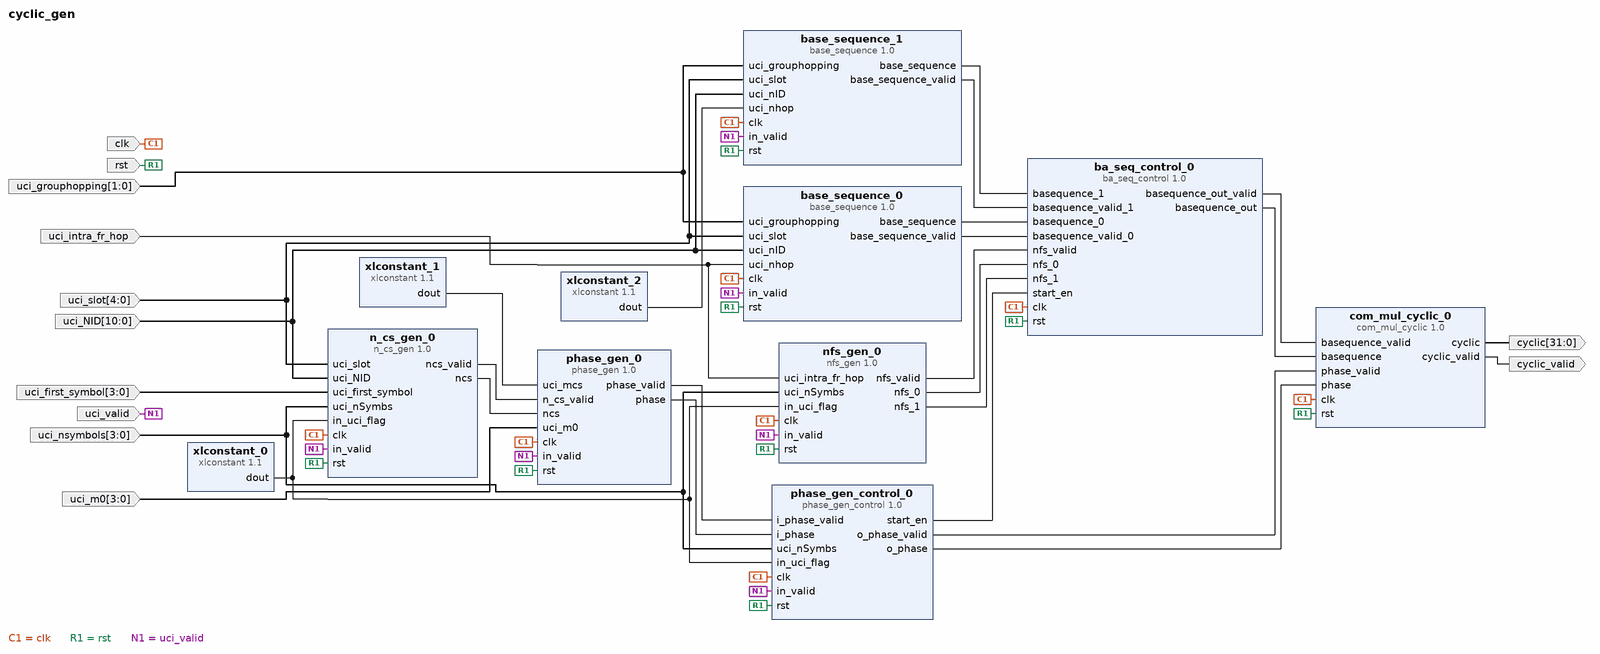
[diagram p0: block diagram of the top level]
# Vivado block design cyclic_gen, xcvu9p-flga2104-2L-e, Vivado 2019.2
create_bd_design cyclic_gen

create_bd_port -dir I -type clk clk
set_property -dict {CONFIG.FREQ_HZ 100000000} [get_bd_ports clk]
create_bd_port -dir I -type rst rst
set_property -dict {CONFIG.POLARITY ACTIVE_HIGH} [get_bd_ports rst]
create_bd_port -dir I uci_valid
create_bd_port -dir I -from 4 -to 0 uci_slot
create_bd_port -dir I -from 1 -to 0 uci_grouphopping
create_bd_port -dir I -from 10 -to 0 uci_NID
create_bd_port -dir I -from 3 -to 0 uci_nsymbols
create_bd_port -dir I uci_intra_fr_hop
create_bd_port -dir I -from 3 -to 0 uci_first_symbol
create_bd_port -dir I -from 3 -to 0 uci_m0
create_bd_port -dir O cyclic_valid
create_bd_port -dir O -from 31 -to 0 cyclic

create_bd_cell -type ip -vlnv xilinx.com:user:phase_gen:1.0 phase_gen_0
create_bd_cell -type ip -vlnv xilinx.com:user:ba_seq_control:1.0 ba_seq_control_0
create_bd_cell -type ip -vlnv xilinx.com:ip:xlconstant:1.1 xlconstant_0
set_property -dict {CONFIG.CONST_VAL 0} [get_bd_cells xlconstant_0]
create_bd_cell -type ip -vlnv xilinx.com:ip:xlconstant:1.1 xlconstant_1
set_property -dict {CONFIG.CONST_VAL 0 CONFIG.CONST_WIDTH 4} [get_bd_cells xlconstant_1]
create_bd_cell -type ip -vlnv xilinx.com:ip:xlconstant:1.1 xlconstant_2
set_property -dict {CONFIG.CONST_VAL 0} [get_bd_cells xlconstant_2]
create_bd_cell -type ip -vlnv xilinx.com:user:com_mul_cyclic:1.0 com_mul_cyclic_0
create_bd_cell -type ip -vlnv xilinx.com:user:phase_gen_control:1.0 phase_gen_control_0
create_bd_cell -type ip -vlnv xilinx.com:user:base_sequence:1.0 base_sequence_0
create_bd_cell -type ip -vlnv xilinx.com:user:base_sequence:1.0 base_sequence_1
create_bd_cell -type ip -vlnv xilinx.com:user:n_cs_gen:1.0 n_cs_gen_0
create_bd_cell -type ip -vlnv xilinx.com:user:nfs_gen:1.0 nfs_gen_0

# ---- connections ----

connect_bd_net [get_bd_ports clk] \
  [get_bd_pins ba_seq_control_0/clk] [get_bd_pins phase_gen_0/clk] [get_bd_pins com_mul_cyclic_0/clk] \
  [get_bd_pins phase_gen_control_0/clk] [get_bd_pins base_sequence_0/clk] [get_bd_pins base_sequence_1/clk] \
  [get_bd_pins n_cs_gen_0/clk] [get_bd_pins nfs_gen_0/clk]
connect_bd_net [get_bd_ports rst] \
  [get_bd_pins ba_seq_control_0/rst] [get_bd_pins phase_gen_0/rst] [get_bd_pins com_mul_cyclic_0/rst] \
  [get_bd_pins phase_gen_control_0/rst] [get_bd_pins base_sequence_0/rst] [get_bd_pins base_sequence_1/rst] \
  [get_bd_pins n_cs_gen_0/rst] [get_bd_pins nfs_gen_0/rst]
connect_bd_net -net in_valid_1 [get_bd_ports uci_valid] \
  [get_bd_pins phase_gen_0/in_valid] [get_bd_pins phase_gen_control_0/in_valid] [get_bd_pins base_sequence_0/in_valid] \
  [get_bd_pins base_sequence_1/in_valid] [get_bd_pins n_cs_gen_0/in_valid] [get_bd_pins nfs_gen_0/in_valid]
connect_bd_net [get_bd_ports uci_slot] [get_bd_pins base_sequence_0/uci_slot] [get_bd_pins base_sequence_1/uci_slot] [get_bd_pins n_cs_gen_0/uci_slot]
connect_bd_net [get_bd_ports uci_grouphopping] [get_bd_pins base_sequence_0/uci_grouphopping] [get_bd_pins base_sequence_1/uci_grouphopping]
connect_bd_net [get_bd_ports uci_NID] [get_bd_pins base_sequence_0/uci_nID] [get_bd_pins base_sequence_1/uci_nID] [get_bd_pins n_cs_gen_0/uci_NID]
connect_bd_net [get_bd_pins base_sequence_0/base_sequence] [get_bd_pins ba_seq_control_0/basequence_0]
connect_bd_net [get_bd_pins base_sequence_1/base_sequence] [get_bd_pins ba_seq_control_0/basequence_1]
connect_bd_net [get_bd_pins base_sequence_0/base_sequence_valid] [get_bd_pins ba_seq_control_0/basequence_valid_0]
connect_bd_net [get_bd_pins base_sequence_1/base_sequence_valid] [get_bd_pins ba_seq_control_0/basequence_valid_1]
connect_bd_net [get_bd_ports uci_nsymbols] \
  [get_bd_pins phase_gen_control_0/uci_nSymbs] [get_bd_pins n_cs_gen_0/uci_nSymbs] [get_bd_pins nfs_gen_0/uci_nSymbs]
connect_bd_net [get_bd_ports uci_intra_fr_hop] [get_bd_pins base_sequence_0/uci_nhop] [get_bd_pins nfs_gen_0/uci_intra_fr_hop]
connect_bd_net [get_bd_pins nfs_gen_0/nfs_valid] [get_bd_pins ba_seq_control_0/nfs_valid]
connect_bd_net [get_bd_pins nfs_gen_0/nfs_0] [get_bd_pins ba_seq_control_0/nfs_0]
connect_bd_net [get_bd_pins nfs_gen_0/nfs_1] [get_bd_pins ba_seq_control_0/nfs_1]
connect_bd_net [get_bd_pins xlconstant_0/dout] \
  [get_bd_pins phase_gen_control_0/in_uci_flag] [get_bd_pins n_cs_gen_0/in_uci_flag] [get_bd_pins nfs_gen_0/in_uci_flag]
connect_bd_net [get_bd_ports uci_first_symbol] [get_bd_pins n_cs_gen_0/uci_first_symbol]
connect_bd_net -net uci_m0_1 [get_bd_ports uci_m0] [get_bd_pins phase_gen_0/uci_m0]
connect_bd_net [get_bd_pins xlconstant_1/dout] [get_bd_pins phase_gen_0/uci_mcs]
connect_bd_net [get_bd_pins n_cs_gen_0/ncs_valid] [get_bd_pins phase_gen_0/n_cs_valid]
connect_bd_net [get_bd_pins n_cs_gen_0/ncs] [get_bd_pins phase_gen_0/ncs]
connect_bd_net [get_bd_pins ba_seq_control_0/basequence_out_valid] [get_bd_pins com_mul_cyclic_0/basequence_valid]
connect_bd_net [get_bd_pins ba_seq_control_0/basequence_out] [get_bd_pins com_mul_cyclic_0/basequence]
connect_bd_net [get_bd_pins com_mul_cyclic_0/cyclic_valid] [get_bd_ports cyclic_valid]
connect_bd_net [get_bd_pins com_mul_cyclic_0/cyclic] [get_bd_ports cyclic]
connect_bd_net [get_bd_pins xlconstant_2/dout] [get_bd_pins base_sequence_1/uci_nhop]
connect_bd_net [get_bd_pins phase_gen_0/phase_valid] [get_bd_pins phase_gen_control_0/i_phase_valid]
connect_bd_net [get_bd_pins phase_gen_0/phase] [get_bd_pins phase_gen_control_0/i_phase]
connect_bd_net [get_bd_pins phase_gen_control_0/start_en] [get_bd_pins ba_seq_control_0/start_en]
connect_bd_net [get_bd_pins phase_gen_control_0/o_phase_valid] [get_bd_pins com_mul_cyclic_0/phase_valid]
connect_bd_net [get_bd_pins phase_gen_control_0/o_phase] [get_bd_pins com_mul_cyclic_0/phase]

validate_bd_design
save_bd_design
